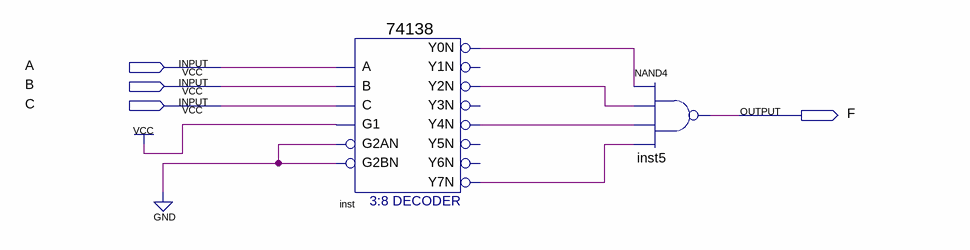
[diagram p0: schematic sheet]
// Quartus schematic F.bdf as structural Verilog: 2 symbols, 4 pins
module F (
  input  A,
  input  B,
  input  C,
  output F
);

  wire inst_y0n, inst_y2n, inst_y4n, inst_y7n;

  \74138  inst (
    .A(A), .B(B), .G1(1'b1), .C(C), .G2AN(1'b0), .G2BN(1'b0), .Y0N(inst_y0n), .Y2N(inst_y2n), .Y4N(inst_y4n),
    .Y7N(inst_y7n));  // open: Y1N, Y3N, Y5N, Y6N
  nand inst5 (F, inst_y0n, inst_y2n, inst_y4n, inst_y7n);
endmodule
